# EAGLE schematic mini-bridge (EAGLE 5.07)
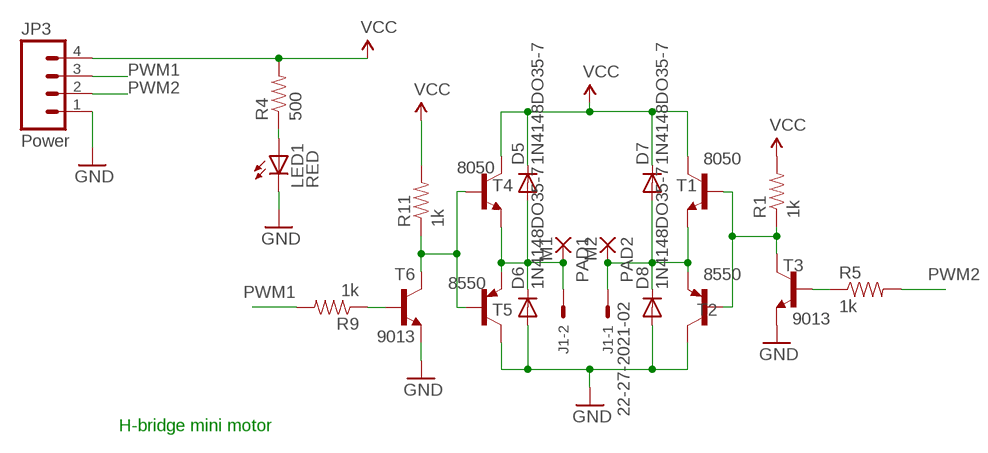
[diagram p0: schematic, sheet 1]

## Parts
D5  1N4148DO35-7  DIODE1N4148  [DIODE-1N4148]
D6  1N4148DO35-7  DIODE1N4148  [DIODE-1N4148]
D7  1N4148DO35-7  DIODE1N4148  [DIODE-1N4148]
D8  1N4148DO35-7  DIODE1N4148  [DIODE-1N4148]
J1  22-27-2021-02  [6410-02]
JP3  Power  M04LOCK_LONGPADS  [1X04_LOCK_LONGPADS]
LED1  RED  LED0805  [CHIPLED_0805]
PAD1  M1  2,15/1,0  [2,15/1,0]
PAD2  M2  2,15/1,0  [2,15/1,0]
R1  1k  RESISTORPTH1  [AXIAL-0.3]
R4  500  RESISTOR  [0805]
R5  1k  RESISTORPTH1  [AXIAL-0.3]
R9  1k  RESISTORPTH1  [AXIAL-0.3]
R11  1k  RESISTORPTH1  [AXIAL-0.3]
T1  8050  BC808-NPN-SOT23-BEC  [SOT23-BEC]
T2  8550  BC857C-PNP-SOT23-BEC  [SOT23-BEC]
T3  9013  TRANSISTOR_NPNSOT23  [SOT23]
T4  8050  BC808-NPN-SOT23-BEC  [SOT23-BEC]
T5  8550  BC807-16-PNP-SOT23-BEC  [SOT23-BEC]
T6  9013  TRANSISTOR_NPNSOT23  [SOT23]

## Nets
GND: D6.A D8.A JP3.1 LED1.C T2.C T3.2(E) T5.C T6.2(E)
N$1: LED1.A R4.1
N$2: D7.A D8.C J1.1 PAD2.1(P) T1.E T2.E
N$3: R9.P$1 T6.1(B)
N$6: R11.P$1 T4.B T5.B T6.3(C)
N$7: R1.P$1 T1.B T2.B T3.3(C)
N$10: R5.P$1 T3.1(B)
N$17: D5.A D6.C J1.2 PAD1.1(P) T4.E T5.E
PWM1: JP3.3 R9.P$2
PWM2: JP3.2 R5.P$2
VCC: D5.C D7.C JP3.4 R1.P$2 R4.2 R11.P$2 T1.C T4.C

## Notes on the sheet
- H-bridge mini motor

## Library data of the parts
D5-D8 = SparkFun:DIODE: Diode These are standard reverse protection diodes and small signal diodes. SMA package can handle up to about 1A. SOD-323 can handle about 200mA. What the SOD-323 package when ordering, there are some mfgs out there that are 5-pin packages.
J1 = con-molex:22-?-02: CONNECTOR wire to board 2.54 mm (.1 inch) pitch header
JP3 = SparkFun:M04: Header 4 Standard 4-pin 0.1" header. Use with straight break away headers (SKU : PRT-00116), right angle break away headers (PRT-00553), swiss pins (PRT-00743), machine pins (PRT-00117), and female headers (PRT-00115). Molex polarized connector foot print use with SKU : PRT-08231 with associated crimp pins and housings.
LED1 = digital-toy:LED: LEDs Standard schematic elements and footprints for 5mm, 3mm, 1206, and 0603 sized LEDs. 5mm - Spark Fun Electronics SKU : COM-00529 (and others) copy led.lbr 0805 led here, by hyl digital-toy. 2010.6.29
PAD1 PAD2 = wirepad:2,15/1,0: THROUGH-HOLE PAD
R1 R4 R5 R9 R11 = SparkFun:RESISTOR: Resistor Basic schematic elements and footprints for 0603, 1206, and PTH 1/10th watt (small) resistors.
T1 T4 = digital-toy:*-NPN-: NPN Transistror most of sot-23 use the pacages sot23-BEC, top C, left B, right E. by hyl, digital-toy. and to-92 use ebc(from-top) by hyl, digital-toy.
T2 T5 = digital-toy:*-PNP-: PNP Transistror
T3 T6 = digital-toy:TRANSISTOR_NPN: Transistor NPN BJT configuration in SOT23 package. MMBT2222 is the common NPN we use. Double check BCE configuration again layout. copy from spark-fun, here is the typical sot-23,to-92 tansistor, sot23-BEC, to92-EBC,compare to *NPN* device, by hyl